# Altium project HEBoard_Ver.PrjPcb
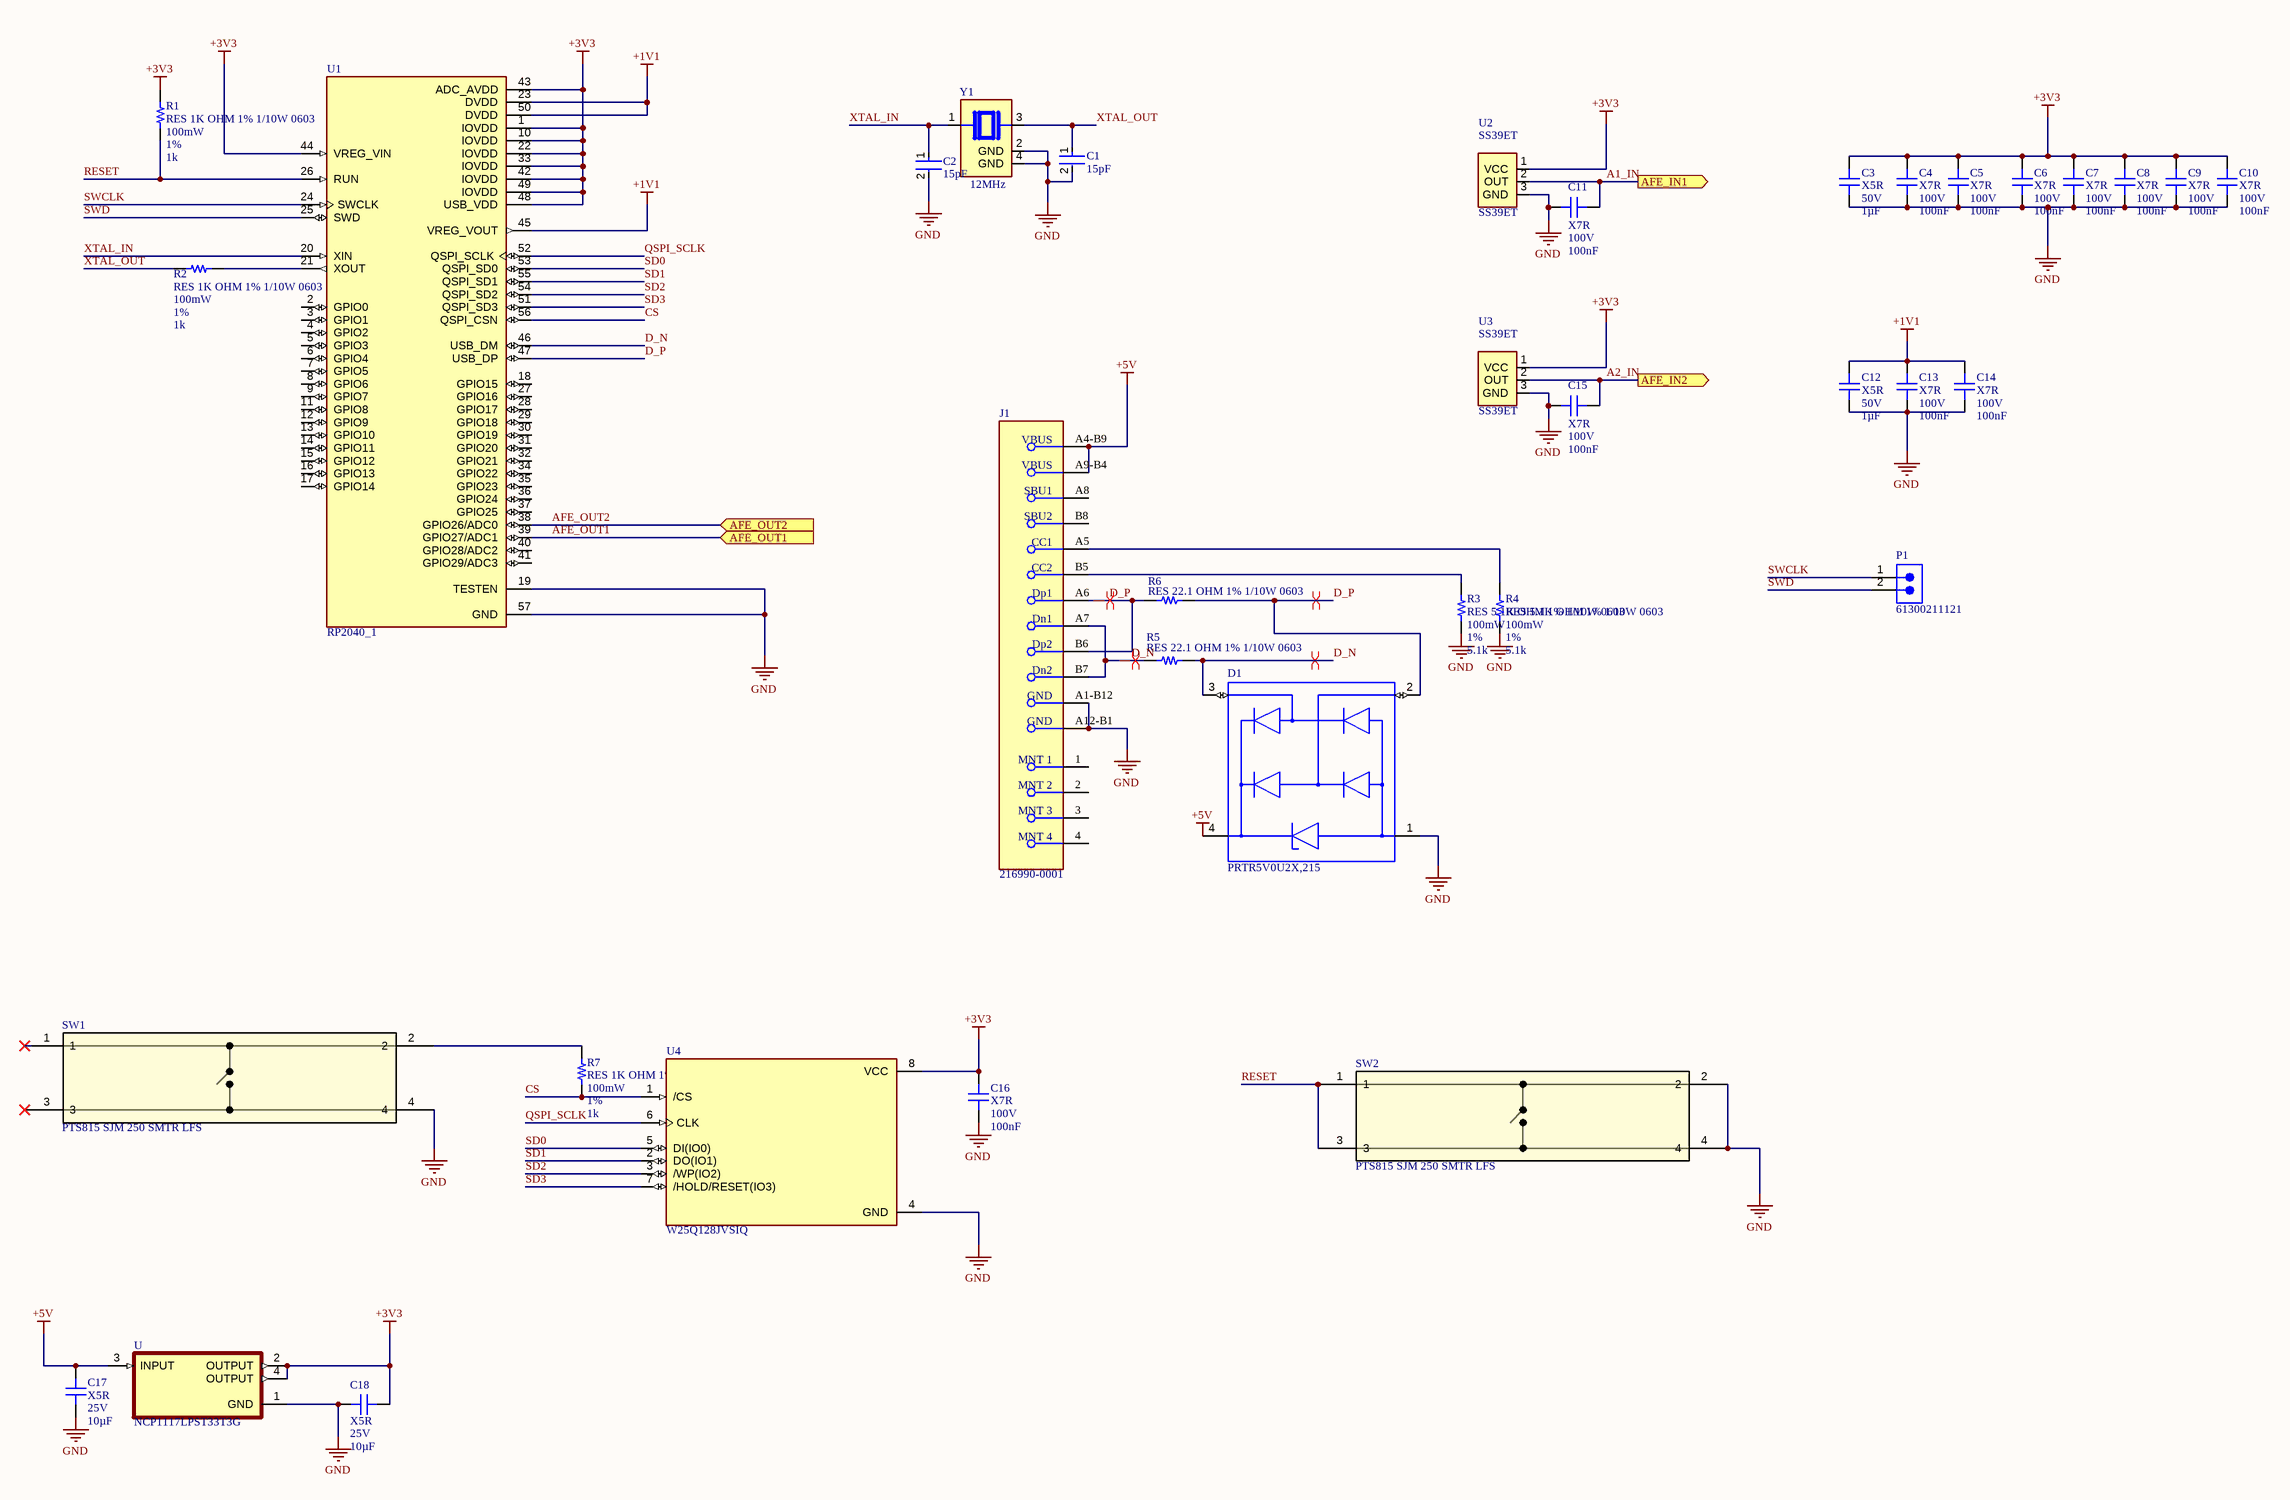
[diagram p0: HEBoard_ver4.SchDoc]
CAGE_CODE: ?????; CONTRACT_NUMBER: <CONTRACT NO>; DOC_NO_ASSY_DWG: <ASSY DWG NO>; DOC_NO_BOM: <BOM DOC NO>; DOC_NO_FAB_DWG: <FAB DWG NO>; DOC_NO_SCH_DWG: <SCH DWG NO>; PCB_2_DEC_TOL: +/-.01; PCB_3_DEC_TOL: +/-.010; PCB_ANG_TOL: +/-1/2; PCB_ASSEMBLY_NO: <PCB ASSY NO>; PCB_CHECKER: - -----; PCB_CHECKER_APP_DATE: --/--/----; PCB_DESIGNER: - -----; PCB_DESIGNER_APP_DATE: --/--/----; PCB_DWG_NO: <PCB DWG NO>; PCB_ENGINEER: - -----; PCB_ENGINEER_APP_DATE: --/--/----; PCB_PART_NUMBER: <PCB PN>; PCB_REV: A; SCH_REV: A
2 sheets, 52 parts. Net scope: flat (ports and power ports of the same name join across sheets).
Board file: PCB1.PcbDoc
Sheets:
  HEBoard_ver4.SchDoc
  HEBoard_AFE.SchDoc

## Sheet HEBoard_ver4.SchDoc
size 594 x 420 mm; SheetNumber: 1; SheetTotal: 2; ENG_APP_DATE: --/--/--; DSN_APP_DATE: --/--/--; CHK_APP_DATE: --/--/--

### Parts
C1  15pF  [FP-CC0603-0_9-MFG]
C2  15pF  [FP-CC0603-0_9-MFG]
C3  Dielectric Code: X5R  Voltage Rating: 50V  Capacitance: 1µF  [CAP 0603_1608]  (hidden comment: CAP CER 1UF 50V X5R 0603)
C4  Dielectric Code: X7R  Voltage Rating: 100V  Capacitance: 100nF  [CAP 0603_1608]  (hidden comment: CAP CER 0.1UF 100V 10% X7R 0603)
C5  Dielectric Code: X7R  Voltage Rating: 100V  Capacitance: 100nF  [CAP 0603_1608]  (hidden comment: CAP CER 0.1UF 100V 10% X7R 0603)
C6  Dielectric Code: X7R  Voltage Rating: 100V  Capacitance: 100nF  [CAP 0603_1608]  (hidden comment: CAP CER 0.1UF 100V 10% X7R 0603)
C7  Dielectric Code: X7R  Voltage Rating: 100V  Capacitance: 100nF  [CAP 0603_1608]  (hidden comment: CAP CER 0.1UF 100V 10% X7R 0603)
C8  Dielectric Code: X7R  Voltage Rating: 100V  Capacitance: 100nF  [CAP 0603_1608]  (hidden comment: CAP CER 0.1UF 100V 10% X7R 0603)
C9  Dielectric Code: X7R  Voltage Rating: 100V  Capacitance: 100nF  [CAP 0603_1608]  (hidden comment: CAP CER 0.1UF 100V 10% X7R 0603)
C10  Dielectric Code: X7R  Voltage Rating: 100V  Capacitance: 100nF  [CAP 0603_1608]  (hidden comment: CAP CER 0.1UF 100V 10% X7R 0603)
C11  Dielectric Code: X7R  Voltage Rating: 100V  Capacitance: 100nF  [CAP 0603_1608]  (hidden comment: CAP CER 0.1UF 100V 10% X7R 0603)
C12  Dielectric Code: X5R  Voltage Rating: 50V  Capacitance: 1µF  [CAP 0603_1608]  (hidden comment: CAP CER 1UF 50V X5R 0603)
C13  Dielectric Code: X7R  Voltage Rating: 100V  Capacitance: 100nF  [CAP 0603_1608]  (hidden comment: CAP CER 0.1UF 100V 10% X7R 0603)
C14  Dielectric Code: X7R  Voltage Rating: 100V  Capacitance: 100nF  [CAP 0603_1608]  (hidden comment: CAP CER 0.1UF 100V 10% X7R 0603)
C15  Dielectric Code: X7R  Voltage Rating: 100V  Capacitance: 100nF  [CAP 0603_1608]  (hidden comment: CAP CER 0.1UF 100V 10% X7R 0603)
C16  Dielectric Code: X7R  Voltage Rating: 100V  Capacitance: 100nF  [CAP 0603_1608]  (hidden comment: CAP CER 0.1UF 100V 10% X7R 0603)
C17  Dielectric Code: X5R  Voltage Rating: 25V  Capacitance: 10µF  [CAP 0603_1608]  (hidden comment: CAP CER 10UF 25V 20% X5R 0603)
C18  Dielectric Code: X5R  Voltage Rating: 25V  Capacitance: 10µF  [CAP 0603_1608]  (hidden comment: CAP CER 10UF 25V 20% X5R 0603)
D1  PRTR5V0U2X,215  [FP-SOT143B-MFG]
J1  216990-0001  [FP-216990-0001-MFG]
P1  61300211121  [61300211121]
R1  RES 1K OHM 1% 1/10W 0603  Power Rating: 100mW  Tolerance: 1%  Resistance: 1k  [RES 0603_1608]
R2  RES 1K OHM 1% 1/10W 0603  Power Rating: 100mW  Tolerance: 1%  Resistance: 1k  [RES 0603_1608]
R3  RES 5.1K OHM 1% 1/10W 0603  Power Rating: 100mW  Tolerance: 1%  Resistance: 5.1k  [RES 0603_1608]
R4  RES 5.1K OHM 1% 1/10W 0603  Power Rating: 100mW  Tolerance: 1%  Resistance: 5.1k  [RES 0603_1608]
R5  RES 22.1 OHM 1% 1/10W 0603  [RES 0603_1608]
R6  RES 22.1 OHM 1% 1/10W 0603  [RES 0603_1608]
R7  RES 1K OHM 1% 1/10W 0603  Power Rating: 100mW  Tolerance: 1%  Resistance: 1k  [RES 0603_1608]
SW1  PTS815 SJM 250 SMTR LFS  [SW4_PTS815 SJM 250 SMTR LFS_CNK]
SW2  PTS815 SJM 250 SMTR LFS  [SW4_PTS815 SJM 250 SMTR LFS_CNK]
U  NCP1117LPST33T3G  [SOT230P700X175-4N]
U1  RP2040_1  [QFN40P700X700X90-57N]
U2  SS39ET  [CHRY-MX1A-11NW_V]
U3  SS39ET  [CHRY-MX1A-11NW_V]
U4  W25Q128JVSIQ  [SOIC127P790X216-8N]
Y1  12MHz  [XTAL_ABM8G-12.000MHZ-4Y-T3]

### Ports
AFE_IN1 (out), AFE_IN2 (out), AFE_OUT1 (in), AFE_OUT2 (in)

### Nets
+1V1: C12.2 C13.2 C14.2 U1.23(DVDD) U1.45(VREG_VOUT) U1.50(DVDD)
+3V3: C3.2 C4.2 C5.2 C6.2 C7.2 C8.2 C9.2 C10.2 C16.2 C18.1 R1.2 U.2(OUTPUT) U.4(OUTPUT) U1.1(IOVDD) U1.10(IOVDD) U1.22(IOVDD) U1.33(IOVDD) U1.42(IOVDD) U1.43(ADC_AVDD) U1.44(VREG_VIN) U1.48(USB_VDD) U1.49(IOVDD) U2.1(VCC) U3.1(VCC) U4.8(VCC)
+5V: C17.2 D1.4(VCC) J1.A4-B9(VBUS) J1.A9-B4(VBUS) U.3(INPUT)
GND: C1.2 C2.2 C3.1 C4.1 C5.1 C6.1 C7.1 C8.1 C9.1 C10.1 C11.2 C12.1 C13.1 C14.1 C15.2 C16.1 C17.1 C18.2 D1.1(GND) J1.A1-B12(GND) J1.A12-B1(GND) R3.1 R4.1 SW1.4 SW2.2 SW2.4 U.1(GND) U1.19(TESTEN) U1.57(GND) U2.3(GND) U3.3(GND) U4.4(GND) Y1.2(GND) Y1.4(GND)
A1_IN: C11.1 U2.2(OUT) ; port AFE_IN1
A2_IN: C15.1 U3.2(OUT) ; port AFE_IN2
AFE_OUT1: U1.39(GPIO27/ADC1) ; port AFE_OUT1
AFE_OUT2: U1.38(GPIO26/ADC0) ; port AFE_OUT2
CS: R7.2 U1.56(QSPI_CSN) U4.1(/CS)
D_N: D1.3(I/O_2) J1.A7(Dn1) J1.B7(Dn2) R5.1 R5.2 U1.46(USB_DM)
D_P: D1.2(I/O_1) J1.A6(Dp1) J1.B6(Dp2) R6.1 R6.2 U1.47(USB_DP)
QSPI_SCLK: U1.52(QSPI_SCLK) U4.6(CLK)
RESET: R1.1 SW2.1 SW2.3 U1.26(RUN)
SD0: U1.53(QSPI_SD0) U4.5(DI(IO0))
SD1: U1.55(QSPI_SD1) U4.2(DO(IO1))
SD2: U1.54(QSPI_SD2) U4.3(/WP(IO2))
SD3: U1.51(QSPI_SD3) U4.7(/HOLD/RESET(IO3))
SWCLK: P1.1 U1.24(SWCLK)
SWD: P1.2 U1.25(SWD)
XTAL_IN: C2.1 U1.20(XIN) Y1.1
XTAL_OUT: C1.1 R2.2 Y1.3
NetJ1_A5: J1.A5(CC1) R4.2
NetJ1_B5: J1.B5(CC2) R3.2
NetR2_1: R2.1 U1.21(XOUT)
NetR7_1: R7.1 SW1.2

Not connected (* = marked no-connect by the designer): J1 1(MNT_1) 2(MNT_2) 3(MNT_3) 4(MNT_4) A8(SBU1) B8(SBU2); SW1 1* 3*; U1 2(GPIO0) 3(GPIO1) 4(GPIO2) 5(GPIO3) 6(GPIO4) 7(GPIO5) 8(GPIO6) 9(GPIO7) 11(GPIO8) 12(GPIO9) 13(GPIO10) 14(GPIO11) 15(GPIO12) 16(GPIO13) 17(GPIO14) 18(GPIO15) 27(GPIO16) 28(GPIO17) 29(GPIO18) 30(GPIO19) 31(GPIO20) 32(GPIO21) 34(GPIO22) 35(GPIO23) 36(GPIO24) 37(GPIO25) 40(GPIO28/ADC2) 41(GPIO29/ADC3)

### Layout directives
differential pair: D_N, D_P

### Notes on the sheet
- DWG NO:
- REV:
- THIS DOCUMENT AND THE DATA DISCLOSED HEREIN OR
- HEREWITH IS THE PROPERTY OF ALTIUM LIMITED AND MAY
- BE FREELY DISTRIBUTED IN WHOLE. NO RIGHTS ARE
- RESERVED OR EXPRESS OR IMPLIED WARANTEE GIVEN.
- REVISION
- DESCRIPTION
- DATE
- APPROVED
- ENG:
- APPROVALS
- PROJECT
- DSN:
- CHK:
- REFERENCE DOCUMENTS
- PROJECT REVISION:
- TITLE
- DOCUMENT REVISION:
- DESIGN ITEM:
- BOM:
- FAB DWG:
- PCB DWG:
- ASSY DWG:
- SCALE:
- A2
- SIZE
- CAGE CODE
- FILE NAME
- DWG NO.
- SHEET
- OF
- REV

### Library data of the parts
C1 C2 = CMP-03422-001493-1: CAP CER 15PF 50V C0G/NPO 0603; Insulation Resistance: 100GR; Tolerance: 5%; Dielectric: C0G; Dielectric Material: Ceramic; Series: CC; Height: 0.8mm; Number of Pins: 2; Max Operating Temperature: 125°C; Width: 0.031inch; Length: 1.6mm; Mount: Surface Mount; Packaging: Tape and Reel; RoHS Compliant: Yes; Radiation Hardening: No; Voltage Rating: 50V; Min Operating Temperature: -55°C; Case Code (Imperial): 0603; Case Code (Metric): 1608; Capacitance: 15pF; Termination: SMD/SMT; Lead Free: Lead Free; Depth: 0.8mm; Package Quantity: 1; Thickness: 0.035inch; Case/Package: 0603; REACH SVHC: No SVHC
C3 C12 = CMP-013-0013-8: 1µF ±10% 50V Ceramic Capacitor X7R 0603 (1608 Metric); Tolerance: 10%; Case/Package: 0603
C4-C11 C13-C16 = CMP-013-0022-14: Ceramic Capacitor, Multilayer, Ceramic, 100V, 10% +Tol, 10% -Tol, X7R, 15% TC, 0.1uF, Surface Mount, 0603; Case/Package: 0603; Tolerance: 10%
C17 C18 = CMP-013-0018-6: 10µF ±20% 25V Ceramic Capacitor X5R 0603 (1608 Metric); Case/Package: 0603; Tolerance: 20%
D1 = CMP-14436-000007-1: TVS DIODE 5.5V SOT143B
J1 = CMP-04767-000014-1: CONN RCP USB2.0 TYP C 24P SMD RA
P1 = CMP-1712-00002-5: NexarPartId: 20081794; Operating Supply Voltage: 250V; Current Rating: 3A; Gender: Male; Number of Contacts: 2; Pitch: 2.54mm; Connector Type: Male Pin; Contact Resistance: 20mΩ; Contact Plating: Gold; Contact Material: Copper; Number of Pins: 2; Min Operating Temperature: -40°C; Packaging: Bulk; Lead Pitch: 2.54mm; Mount: Through Hole; Orientation: Vertical; RoHS: Compliant; REACH SVHC: No SVHC; Height: 8.94mm; Termination: Through Hole; Number of Positions: 2; Contact Mating Length: 5.9944mm; Color: Black; Contact Gender: Male; Number of Rows: 1; Housing Material: PBT; Lead Free: Lead Free; Voltage Rating: 250V; Max Operating Temperature: 125°C
R1 R2 R7 = CMP-009-00014-17: 1 kOhms ±1% 0.1W, 1/10W Chip Resistor 0603 (1608 Metric) Moisture Resistant Thick Film; Temperature Coefficient: 100ppm/°C; Voltage Rating: 75V; Case/Package: 0603
R3 R4 = CMP-00051-2: 5.1 kOhms ±1% 0.1W, 1/10W Chip Resistor 0603 (1608 Metric) Automotive AEC-Q200 Thick Film; Voltage Rating: 75V; Temperature Coefficient: 100ppm/°C; Case/Package: 0603
R5 R6 = CMP-009-00193-9: Fixed Resistor, Metal Glaze/thick Film, 0.1W, 22.1ohm, 75V, 1% +/-Tol, 100ppm/Cel, Surface Mount, 0603; Temperature Coefficient: 100ppm/°C; Case/Package: 0603; Voltage Rating: 75V
SW1 SW2 = PTS815 SJM 250 SMTR LFS: No Description Available; Mfr_Name: C&K Components; RefDes: RefDes; Type: Type
U = NCP1117LPST33T3G: Linear Voltage Regulator IC 1 Output 1A SOT-223; MF: ON Semiconductor; Availability: Unavailable; Value: *; Package: SOT-223 ON Semiconductor; MP: NCP1117LPST33T3G; Price: None; SnapEDA_Link: https://www.snapeda.com/parts/NCP1117LPST33T3G/ON%20Semiconductor/view-part/421194/?ref=snap
U1 = RP2040_1: RP2040 chip for Raspberry Pi Pico - ARMÂ® CortexÂ®-M0+ MCU 32-Bit; Check_prices: https://www.snapeda.com/parts/RP2040/Raspberry+Pi/view-part/?ref=eda; Value: *; Availability: In Stock; MP: RP2040; Price: None; Package: None; SnapEDA_Link: https://www.snapeda.com/parts/RP2040/Raspberry+Pi/view-part/?ref=snap; Purchase-URL: https://pricing.snapeda.com/search/part/RP2040/?ref=eda; MF: Raspberry Pi
U2 U3 = SS39ET: analog Hall Effect Sensor 1.5 mA 2.7 - 6.5 V dc | Honeywell SS39ET; MF: Honeywell Sensing and Productivity Solutions; SnapEDA_Link: https://www.snapeda.com/parts/SS39ET/Honeywell+Sensing+and+Productivity+Solutions/view-part/?ref=snap; Package: None; Value: *; MP: SS39ET; Check_prices: https://www.snapeda.com/parts/SS39ET/Honeywell+Sensing+and+Productivity+Solutions/view-part/?ref=eda
U4 = W25Q128JVSIQ: FLASH - NOR Memory IC 128Mb (16M x 8) SPI - Quad I/O, QPI, DTR 133 MHz 8-SOIC; MF: Winbond Electronics; Price: None; Purchase-URL: https://pricing.snapeda.com/search/part/W25Q128JVSIQ/?ref=eda; Check_prices: https://www.snapeda.com/parts/W25Q128JVSIQ/Winbond+Electronics/view-part/?ref=eda; Value: *; MP: W25Q128JVSIQ; Package: SOIC-8 Winbond; SnapEDA_Link: https://www.snapeda.com/parts/W25Q128JVSIQ/Winbond+Electronics/view-part/?ref=snap; Availability: In Stock
Y1 = ABM8G-12.000MHZ-4Y-T3: 12 MHz Â±30ppm Crystal 10pF 120 Ohms 4-SMD, No Lead; MF: Abracon; SnapEDA_Link: https://www.snapeda.com/parts/ABM8G-12.000MHZ-4Y-T3/Abracon+LLC/view-part/?ref=snap; Price: None; Check_prices: https://www.snapeda.com/parts/ABM8G-12.000MHZ-4Y-T3/Abracon+LLC/view-part/?ref=eda; Purchase-URL: https://pricing.snapeda.com/search/part/ABM8G-12.000MHZ-4Y-T3/?ref=eda; Availability: In Stock; Package: SMD-4 Abracon; MP: ABM8G-12.000MHZ-4Y-T3; Value: *

## Sheet HEBoard_AFE.SchDoc
size 431 x 279 mm; SheetNumber: 2; SheetTotal: 1
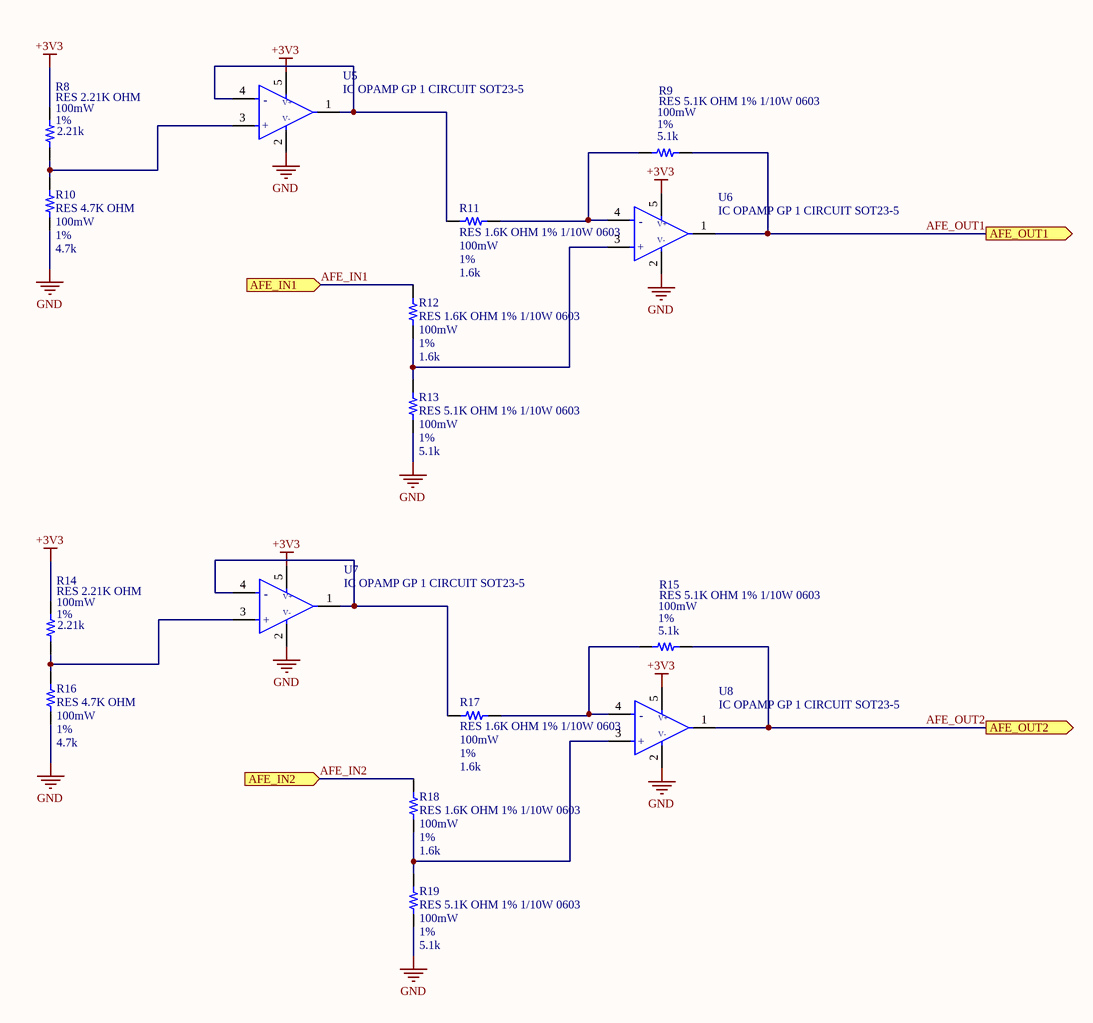
[diagram p1: HEBoard_AFE.SchDoc]

### Parts
R8  RES 2.21K OHM  Power Rating: 100mW  Tolerance: 1%  Resistance: 2.21k  [RES 0603_1608]
R9  RES 5.1K OHM 1% 1/10W 0603  Power Rating: 100mW  Tolerance: 1%  Resistance: 5.1k  [RES 0603_1608]
R10  RES 4.7K OHM  Power Rating: 100mW  Tolerance: 1%  Resistance: 4.7k  [RES 0603_1608]
R11  RES 1.6K OHM 1% 1/10W 0603  Power Rating: 100mW  Tolerance: 1%  Resistance: 1.6k  [RES 0603_1608]
R12  RES 1.6K OHM 1% 1/10W 0603  Power Rating: 100mW  Tolerance: 1%  Resistance: 1.6k  [RES 0603_1608]
R13  RES 5.1K OHM 1% 1/10W 0603  Power Rating: 100mW  Tolerance: 1%  Resistance: 5.1k  [RES 0603_1608]
R14  RES 2.21K OHM  Power Rating: 100mW  Tolerance: 1%  Resistance: 2.21k  [RES 0603_1608]
R15  RES 5.1K OHM 1% 1/10W 0603  Power Rating: 100mW  Tolerance: 1%  Resistance: 5.1k  [RES 0603_1608]
R16  RES 4.7K OHM  Power Rating: 100mW  Tolerance: 1%  Resistance: 4.7k  [RES 0603_1608]
R17  RES 1.6K OHM 1% 1/10W 0603  Power Rating: 100mW  Tolerance: 1%  Resistance: 1.6k  [RES 0603_1608]
R18  RES 1.6K OHM 1% 1/10W 0603  Power Rating: 100mW  Tolerance: 1%  Resistance: 1.6k  [RES 0603_1608]
R19  RES 5.1K OHM 1% 1/10W 0603  Power Rating: 100mW  Tolerance: 1%  Resistance: 5.1k  [RES 0603_1608]
U5  IC OPAMP GP 1 CIRCUIT SOT23-5  [SOT 23-5]
U6  IC OPAMP GP 1 CIRCUIT SOT23-5  [SOT 23-5]
U7  IC OPAMP GP 1 CIRCUIT SOT23-5  [SOT 23-5]
U8  IC OPAMP GP 1 CIRCUIT SOT23-5  [SOT 23-5]

### Ports
AFE_IN1 (in), AFE_IN2 (in), AFE_OUT1 (out), AFE_OUT2 (out)

### Nets
+3V3: R8.1 R14.1 U5.5(V+) U6.5(V+) U7.5(V+) U8.5(V+)
GND: R10.2 R13.1 R16.2 R19.1 U5.2(V-) U6.2(V-) U7.2(V-) U8.2(V-)
AFE_IN1: R12.2 ; port AFE_IN1  [project net A1_IN]
AFE_IN2: R18.2 ; port AFE_IN2  [project net A2_IN]
AFE_OUT1: R9.2 U6.1(OUT) ; port AFE_OUT1
AFE_OUT2: R15.2 U8.1(OUT) ; port AFE_OUT2
NetR8_2: R8.2 R10.1 U5.3(IN+)
NetR9_1: R9.1 R11.1 U6.4(IN-)
NetR11_2: R11.2 U5.1(OUT) U5.4(IN-)
NetR12_1: R12.1 R13.2 U6.3(IN+)
NetR14_2: R14.2 R16.1 U7.3(IN+)
NetR15_1: R15.1 R17.1 U8.4(IN-)
NetR17_2: R17.2 U7.1(OUT) U7.4(IN-)
NetR18_1: R18.1 R19.2 U8.3(IN+)

### Notes on the sheet
- DWG. NO.
- REV.
- SHT.
- THIS DOCUMENT AND THE DATA DISCLOSED HEREIN OR HEREWITH IS THE PROPERTY OF ALTIUM LIMITED AND MAY BE FREELY DISTRIBUTED IN WHOLE. NO RIGHTS ARE RESERVED OR EXPRESS OR IMPLIED WARANTEE GIVEN.
- REVISION
- DESCRIPTION
- DATE
- APPROVED
- ENG:
- APPROVALS
- PROJECT
- DSN:
- CHK:
- REFERENCE DOCUMENTS
- PROJECT REVISION:
- TITLE
- DOCUMENT REVISION:
- DESIGN ITEM:
- BOM:
- FAB DWG:
- PCB DWG:
- ASSY DWG:
- SCALE:
- SIZE
- B
- CAGE CODE
- FILE NAME
- DWG NO.
- SHEET
- OF
- REV
- (in symbol CMP-031-00034-5) -; +

### Library data of the parts
R8 R14 = CMP-010-0027-7: 2.21 kOhms ±1% 0.1W, 1/10W Chip Resistor 0603 (1608 Metric) Automotive AEC-Q200, Moisture Resistant Thick Film; Voltage Rating: 75V; Temperature Coefficient: 100ppm/°C; Case/Package: 0603
R9 R13 R15 R19 = CMP-00051-2: as R3 on sheet HEBoard_ver4; Case/Package: 0603
R10 R16 = CMP-010-0075-8: Fixed Resistor, Metal Glaze/thick Film, 0.1W, 4700ohm, 75V, 1% +/-Tol, 100ppm/Cel, Surface Mount, 0603; Temperature Coefficient: 100ppm/°C; Case/Package: 0603; Voltage Rating: 75V
R11 R12 R17 R18 = CMP-010-0019-7: 1.6 kOhms ±1% 0.1W, 1/10W Chip Resistor 0603 (1608 Metric) Moisture Resistant Thick Film; Voltage Rating: 75V; Temperature Coefficient: 100ppm/°C; Case/Package: 0603
U5-U8 = CMP-031-00034-5: General Purpose Amplifier 1 Circuit Rail-to-Rail SOT-23-5; Manufacturer 1: TI; Manufacturer Part Number: TLV9051IDBVR; Max Supply Voltage: 5.5V; Min Supply Voltage: 1.8V; Min Operating Temperature: -40°C; Mounting Technology: Surface Mount; Supplier 1: DigiKey; Case/Package: SOT-23-5; Max Operating Temperature: 125°C; Supplier Part Number 1: 296-TLV9051IDBVRCT-ND; Pins: 5

## Nets that join several sheets
+3V3: HEBoard_ver4 (25 pins), HEBoard_AFE (6 pins)
GND: HEBoard_ver4 (34 pins), HEBoard_AFE (8 pins)
A1_IN: HEBoard_ver4 (C11.1 U2.2), HEBoard_AFE (R12.2)
A2_IN: HEBoard_ver4 (C15.1 U3.2), HEBoard_AFE (R18.2)
AFE_OUT1: HEBoard_ver4 (U1.39), HEBoard_AFE (R9.2 U6.1)
AFE_OUT2: HEBoard_ver4 (U1.38), HEBoard_AFE (R15.2 U8.1)